# EAGLE design TSOC_RS485_EM_R5_0 (EAGLE 6.6.0)
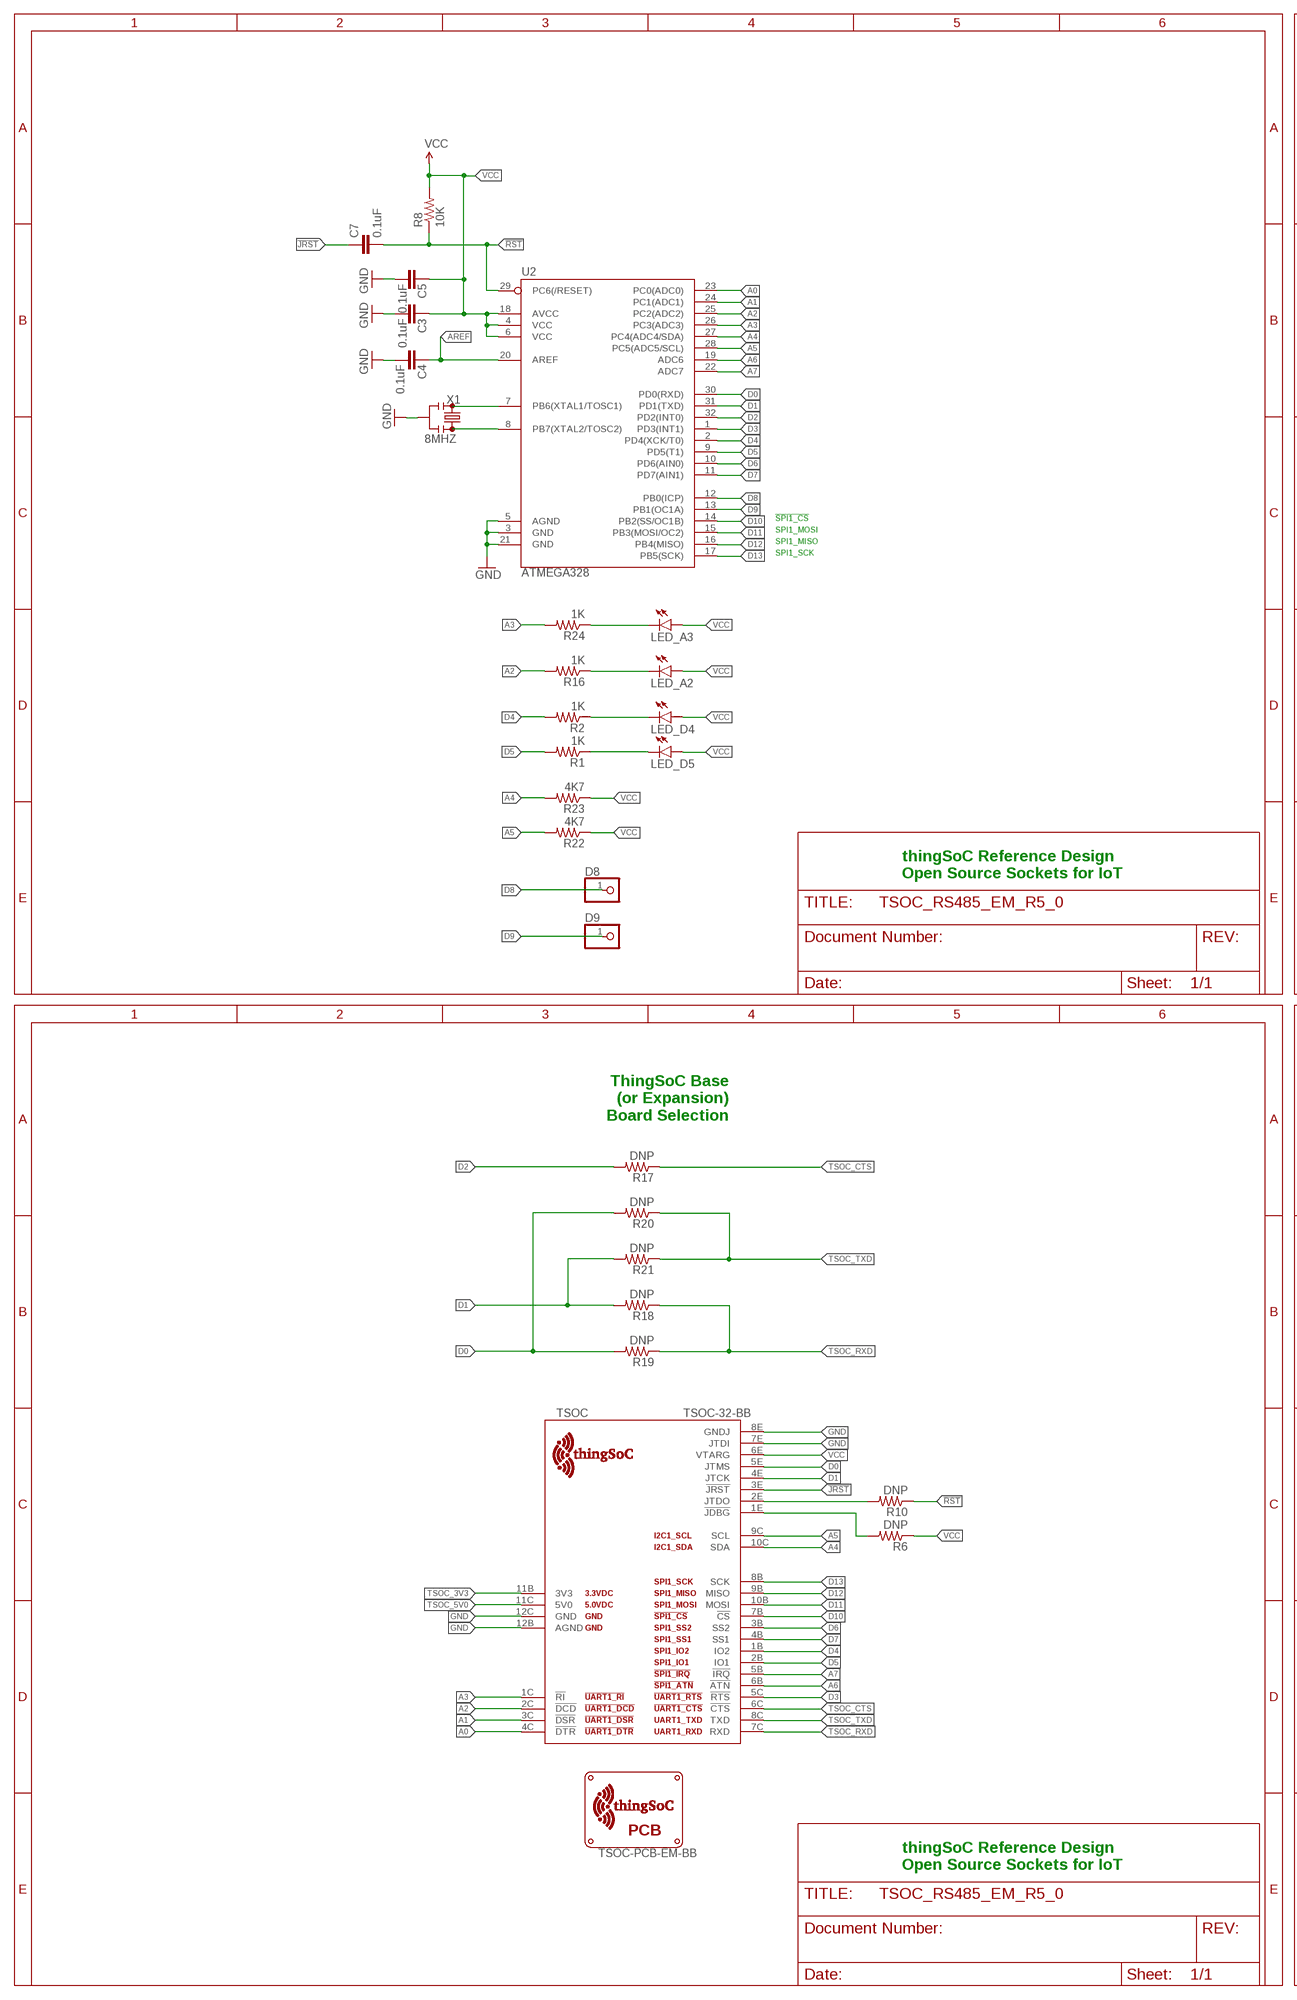
[diagram p0: schematic, sheet 1, part 1 of 2]
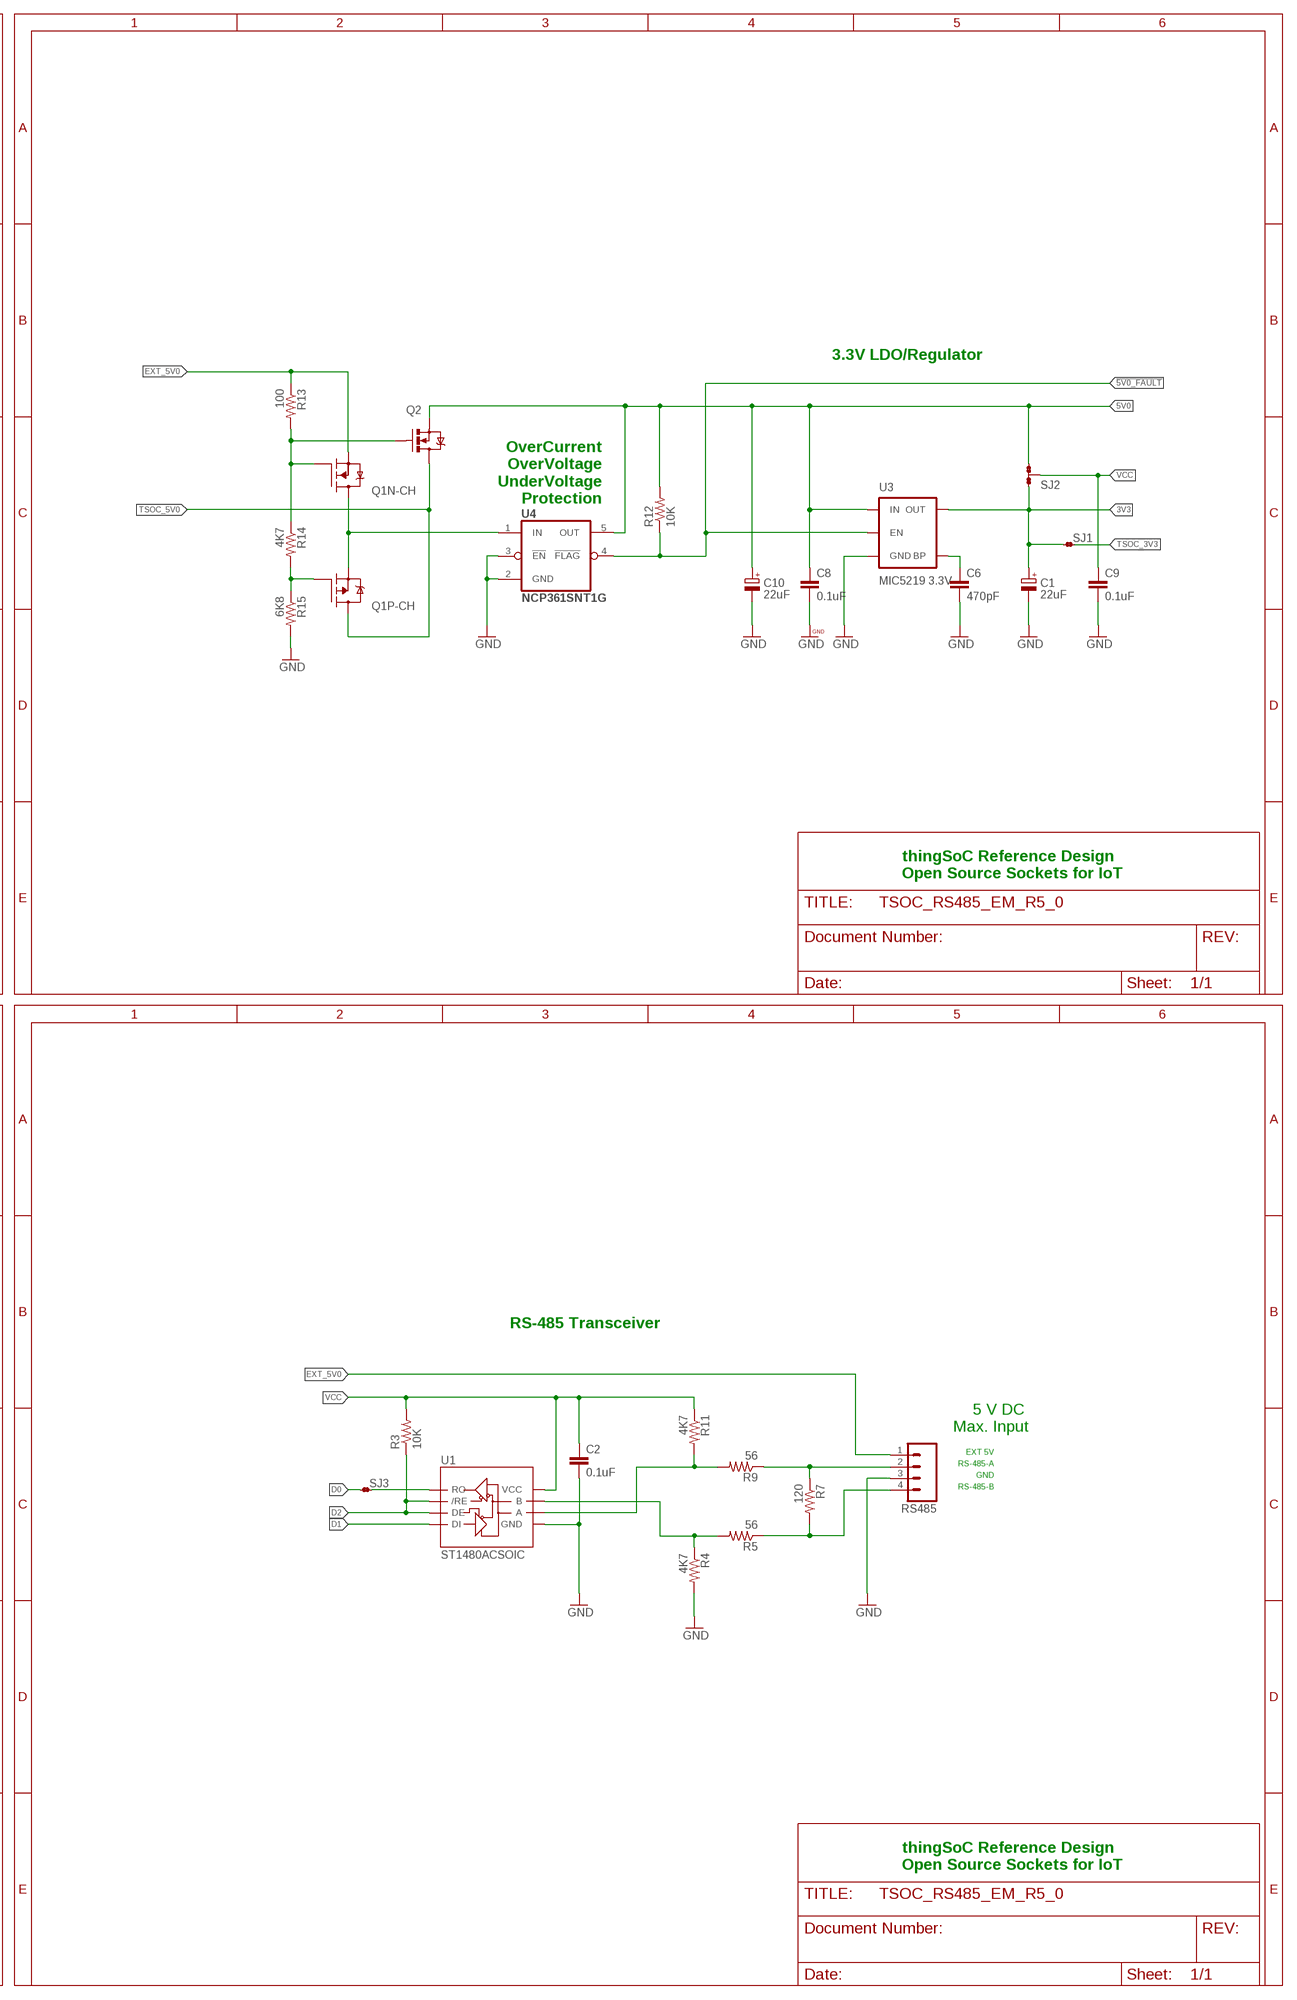
[diagram p1: schematic, sheet 1, part 2 of 2]

## Parts
C1  22uF  CPOL-EUSMCB  [SMC_B]
C2  0.1uF  CAP0402-CAP  [0402-CAP]
C3  0.1uF  CAP0402-CAP  [0402-CAP]
C4  0.1uF  CAP0402-CAP  [0402-CAP]
C5  0.1uF  CAP0402-CAP  [0402-CAP]
C6  470pF  CAP0402-CAP  [0402-CAP]
C7  0.1uF  CAP0402-CAP  [0402-CAP]
C8  0.1uF  CAP0402-CAP  [0402-CAP]
C9  0.1uF  CAP0402-CAP  [0402-CAP]
C10  22uF  CPOL-EUSMCB  [SMC_B]
D8  WPAD-1-0402  [WPAD-1-0402]
D9  WPAD-1-0402  [WPAD-1-0402]
LED_A2  LED0603  [LED-0603]
LED_A3  LED0603  [LED-0603]
LED_D4  LED0603  [LED-0603]
LED_D5  LED0603  [LED-0603]
Q1  FDC6420C  [SOT95P280X110-6N]
Q2  MOSFET-NCHANNELAO3404A  [SOT23-3]
R1  1K  RESISTOR0402  [0402-RES]
R2  1K  RESISTOR0402  [0402-RES]
R3  10K  RESISTOR0402  [0402-RES]
R4  4K7  RESISTOR0402  [0402-RES]
R5  56  RESISTOR0402  [0402-RES]
R6  DNP  RESISTOR0402  [0402-RES]
R7  120  RESISTOR0402  [0402-RES]
R8  10K  RESISTOR0402  [0402-RES]
R9  56  RESISTOR0402  [0402-RES]
R10  DNP  RESISTOR0402  [0402-RES]
R11  4K7  RESISTOR0402  [0402-RES]
R12  10K  RESISTOR0402  [0402-RES]
R13  100  RESISTOR0402  [0402-RES]
R14  4K7  RESISTOR0402  [0402-RES]
R15  6K8  RESISTOR0402  [0402-RES]
R16  1K  RESISTOR0402  [0402-RES]
R17  DNP  RESISTOR0402  [0402-RES]
R18  DNP  RESISTOR0402  [0402-RES]
R19  DNP  RESISTOR0402  [0402-RES]
R20  DNP  RESISTOR0402  [0402-RES]
R21  DNP  RESISTOR0402  [0402-RES]
R22  4K7  RESISTOR0402  [0402-RES]
R23  4K7  RESISTOR0402  [0402-RES]
R24  1K  RESISTOR0402  [0402-RES]
RS485  M04SCREW  [SCREWTERMINAL-3.5MM-4]
SJ1  JMP-2-NC  [JMP-2-NC]
SJ2  JMP-3-1_2  [JMP-3-1_2]
SJ3  JMP-2-NC  [JMP-2-NC]
TSOC  TSOC-32-BB  [TSOC-BB-S32]
U1  ST1480ACSOIC  [SO08]
U2  ATMEGA328  ATMEGA168  [TQFP32-08]
U3  MIC5219 3.3V  V_REG_MIC52193.3V  [SOT23-5]
U4  NCP361SNT1G  [SOP95P275X110-5N]
U$1  TSOC-PCB-EM-BB  [TSOC-EM-BB]
X1  8MHZ  RESONATOR8MHZ  [RESONATOR-SMD]

## Nets
3V3: C1.+ SJ1.1 SJ2.1 U3.5(OUT)
5V0: C8.1 C10.+ Q2.2(S) R12.2 SJ2.3 U3.1(IN) U4.5(OUT)
!5V0_FAULT: R12.1 U3.3(EN) U4.4(!FLAG)
!JDBG: R6.2 TSOC.1E(!JDBG)
!JRST: C7.1 TSOC.3E(!JRST)
!RST: C7.2 R8.1 R10.1 U2.29(PC6(/RESET))
A: R9.2 R11.2 U1.6(A)
A0: TSOC.4C(!DTR) U2.23(PC0(ADC0))
A1: TSOC.3C(!DSR) U2.24(PC1(ADC1))
A2: R16.2 TSOC.2C(!DCD) U2.25(PC2(ADC2))
A3: R24.2 TSOC.1C(!RI) U2.26(PC3(ADC3))
A4: R23.2 TSOC.10C(SDA) U2.27(PC4(ADC4/SDA))
A5: R22.2 TSOC.9C(SCL) U2.28(PC5(ADC5/SCL))
A6: TSOC.6B(!ATN) U2.19(ADC6)
A7: TSOC.5B(!IRQ) U2.22(ADC7)
AO: R7.1 R9.1 RS485.2
AREF: C4.2 U2.20(AREF)
B: R4.1 R5.2 U1.7(B)
BO: R5.1 R7.2 RS485.4
BYPASS1: C6.1 U3.4(BP)
D0: R19.2 R20.2 SJ3.1 TSOC.5E(JTMS) U2.30(PD0(RXD))
D1: R18.2 R21.2 TSOC.4E(JTCK) U1.4(DI) U2.31(PD1(TXD))
D2: R3.1 R17.2 U1.2(/RE) U1.3(DE) U2.32(PD2(INT0))
D3: TSOC.5C(!RTS) U2.1(PD3(INT1))
D4: R2.2 TSOC.1B(IO2) U2.2(PD4(XCK/T0))
D5: R1.2 TSOC.2B(IO1) U2.9(PD5(T1))
D6: TSOC.3B(SS2) U2.10(PD6(AIN0))
D7: TSOC.4B(SS1) U2.11(PD7(AIN1))
D8: D8.1 U2.12(PB0(ICP))
D9: D9.1 U2.13(PB1(OC1A))
D10: TSOC.7B(!CS) U2.14(PB2(SS/OC1B))
D11: TSOC.10B(MOSI) U2.15(PB3(MOSI/OC2))
D12: TSOC.9B(MISO) U2.16(PB4(MISO))
D13: TSOC.8B(SCK) U2.17(PB5(SCK))
EXT_5V0: Q1.5(N-CH:S) R13.1 RS485.1
GND: C1.- C2.2 C3.1 C4.1 C5.1 C6.2 C8.2 C9.2 C10.- R4.2 R15.2 RS485.3 TSOC.7E(JTDI) TSOC.8E(GNDJ) TSOC.12B(AGND) TSOC.12C(GND) U1.5(GND) U2.3(GND) U2.5(AGND) U2.21(GND) U3.2(GND) U4.2(GND) U4.3(!EN) X1.2
JTDO: R10.2 TSOC.2E(JTDO)
LEDB: LED_D4.C R2.1
LEDG: LED_A2.C R16.1
LEDR: LED_A3.C R24.1
LEDY: LED_D5.C R1.1
NGATE: Q1.1(N-CH:G) Q2.1(G) R13.2 R14.1
PGATE: Q1.3(P-CH:G) R14.2 R15.1
RXD: SJ3.2 U1.1(RO)
TSOC_3V3: SJ1.2 TSOC.11B(3V3)
TSOC_5V0: Q1.4(P-CH:D) Q2.3(D) TSOC.11C(5V0)
TSOC_CTS: R17.1 TSOC.6C(!CTS)
TSOC_RXD: R18.1 R19.1 TSOC.7C(RXD)
TSOC_TXD: R20.1 R21.1 TSOC.8C(TXD)
VCC: C2.1 C3.2 C5.2 C9.1 LED_A2.A LED_A3.A LED_D4.A LED_D5.A R3.2 R6.1 R8.2 R11.1 R22.1 R23.1 SJ2.2 TSOC.6E(VTARG) U1.8(VCC) U2.4(VCC) U2.6(VCC) U2.18(AVCC)
VIN: Q1.2(P-CH:S) Q1.6(N-CH:D) U4.1(IN)
XIN: U2.7(PB6(XTAL1/TOSC1)) X1.3
XOUT: U2.8(PB7(XTAL2/TOSC2)) X1.1

## Notes on the sheet
- 3.3V LDO/Regulator
- OverCurrent
  OverVoltage
  UnderVoltage
  Protection
- !SPI1_CS
- SPI1_MOSI
- SPI1_MISO
- SPI1_SCK
- thingSoC Reference Design
  Open Source Sockets for IoT
- thingSoC Reference Design
  Open Source Sockets for IoT
- ThingSoC Base
  (or Expansion)
  Board Selection
- RS-485 Transceiver
- 5 V DC 
  Max. Input
- EXT 5V
- RS-485-A
- GND
- RS-485-B
- thingSoC Reference Design
  Open Source Sockets for IoT
- thingSoC Reference Design
  Open Source Sockets for IoT

## Library data of the parts
C1 C10 = rcl:CPOL-EU: POLARIZED CAPACITOR, European symbol
C2-C9 = TSOC-MODBUS-ESM:CAP: Capacitor Standard 0603 ceramic capacitor, and 0.1" leaded capacitor.
D8 D9 = PatternAgents-ProtoPads:WPAD-1: Wire Pad - Single Good for scope lead clips, test jumpers, probe points, etc. PatternAgents ProtoPads Library Schematic and PCB layout libraries for design patterns by PatternAgents. For the CADSoft Eagle CAD program : http://www.cadsoftusa.com/download-eagle/ Source LBR : http://www.patternagents.com Github : https://github.com/PatternAgents License : http://creativecommons.org/licenses/by-sa/4.0/ (Creative Commons 4.0) THIS SOFTWARE IS PROVIDED BY THE CONTRIBUTORS "AS IS" AND WITHOUT ANY EXPRESS OR IMPLIED WARRANTIES, INCLUDING, BUT NOT LIMITED TO, THE IMPLIED WARRANTIES OF MERCHANTABILITY AND FITNESS FOR A PARTICULAR PURPOSE ARE DISCLAIMED. IN NO EVENT SHALL THE COPYRIGHT OWNER OR CONTRIBUTORS BE LIABLE FOR ANY DIRECT, INDIRECT, INCIDENTAL, SPECIAL, EXEMPLARY, OR CONSEQUENTIAL DAMAGES (INCLUDING, BUT NOT LIMITED TO, PROCUREMENT OF SUBSTITUTE GOODS OR SERVICES; LOSS OF USE, DATA, OR PROFITS; OR BUSINESS INTERRUPTION) HOWEVER CAUSED AND ON ANY THEORY OF LIABILITY, WHETHER IN CONTRACT, STRICT LIABILITY, OR TORT (INCLUDING NEGLIGENCE OR OTHERWISE) ARISING IN ANY WAY OUT OF THE USE OF THIS SOFTWARE, EVEN IF ADVISED OF THE POSSIBILITY OF SUCH DAMAGE.; BOM: EXCLUDE
LED_A2 LED_A3 LED_D4 LED_D5 = TSOC-MODBUS-ESM:LED: LEDs Standard schematic elements and footprints for 5mm, 3mm, 1206, and 0603 sized LEDs. 5mm - Spark Fun Electronics SKU : COM-00529 (and others)
Q1 = TSOC-ESP8266-BASE:FDC6420C: N and P Channel Power Trench MOSFETs
Q2 = SparkFun-DiscreteSemi:MOSFET-NCHANNEL: Common NMOSFET Parts MFG P/N Store ID Prod ID FDD8780 TRANS-09984 SI7820DN TRANS-11055 FDS6630A IC-08089 2N7002PW TRANS-11151 FQP30N06L COM-10213 TRANS-10060 BSS123LT1G TRANS-08345 BSS138 TRANS-00830 BS170 2N7000; PROD_ID: TRAN-12988
R1-R24 = TSOC-MODBUS-ESM:RESISTOR: Resistor Basic schematic elements and footprints for 0603, 1206, and PTH resistors.
RS485 = SparkFun-Connectors:M04: Header 4 Standard 4-pin 0.1" header. Use with straight break away headers (SKU : PRT-00116), right angle break away headers (PRT-00553), swiss pins (PRT-00743), machine pins (PRT-00117), and female headers (PRT-00115). Molex polarized connector foot print use with SKU : PRT-08231 with associated crimp pins and housings. 1MM SMD Version SKU: PRT-10208
SJ1 SJ3 = TSOC-MODBUS-ESM:JMP-2-NC: Two Terminal Jumper - Normally Closed Positions 1 and 2 are normally connected. PatternAgents ProtoPads Library Schematic and PCB layout libraries for design patterns by PatternAgents. For the CADSoft Eagle CAD program : http://www.cadsoftusa.com/download-eagle/ Source LBR : http://www.patternagents.com Github : https://github.com/PatternAgents License : http://creativecommons.org/licenses/by-sa/4.0/ (Creative Commons 4.0) THIS SOFTWARE IS PROVIDED BY THE CONTRIBUTORS "AS IS" AND WITHOUT ANY EXPRESS OR IMPLIED WARRANTIES, INCLUDING, BUT NOT LIMITED TO, THE IMPLIED WARRANTIES OF MERCHANTABILITY AND FITNESS FOR A PARTICULAR PURPOSE ARE DISCLAIMED. IN NO EVENT SHALL THE COPYRIGHT OWNER OR CONTRIBUTORS BE LIABLE FOR ANY DIRECT, INDIRECT, INCIDENTAL, SPECIAL, EXEMPLARY, OR CONSEQUENTIAL DAMAGES (INCLUDING, BUT NOT LIMITED TO, PROCUREMENT OF SUBSTITUTE GOODS OR SERVICES; LOSS OF USE, DATA, OR PROFITS; OR BUSINESS INTERRUPTION) HOWEVER CAUSED AND ON ANY THEORY OF LIABILITY, WHETHER IN CONTRACT, STRICT LIABILITY, OR TORT (INCLUDING NEGLIGENCE OR OTHERWISE) ARISING IN ANY WAY OUT OF THE USE OF THIS SOFTWARE, EVEN IF ADVISED OF THE POSSIBILITY OF SUCH DAMAGE.; BOM: EXCLUDE
SJ2 = PatternAgents-ProtoPads:JMP-3-1_2: Three Terminal Jumper - 1 & 2 Connected Positions 1and 2 are normally connected. PatternAgents ProtoPads Library Schematic and PCB layout libraries for design patterns by PatternAgents. For the CADSoft Eagle CAD program : http://www.cadsoftusa.com/download-eagle/ Source LBR : http://www.patternagents.com Github : https://github.com/PatternAgents License : http://creativecommons.org/licenses/by-sa/4.0/ (Creative Commons 4.0) THIS SOFTWARE IS PROVIDED BY THE CONTRIBUTORS "AS IS" AND WITHOUT ANY EXPRESS OR IMPLIED WARRANTIES, INCLUDING, BUT NOT LIMITED TO, THE IMPLIED WARRANTIES OF MERCHANTABILITY AND FITNESS FOR A PARTICULAR PURPOSE ARE DISCLAIMED. IN NO EVENT SHALL THE COPYRIGHT OWNER OR CONTRIBUTORS BE LIABLE FOR ANY DIRECT, INDIRECT, INCIDENTAL, SPECIAL, EXEMPLARY, OR CONSEQUENTIAL DAMAGES (INCLUDING, BUT NOT LIMITED TO, PROCUREMENT OF SUBSTITUTE GOODS OR SERVICES; LOSS OF USE, DATA, OR PROFITS; OR BUSINESS INTERRUPTION) HOWEVER CAUSED AND ON ANY THEORY OF LIABILITY, WHETHER IN CONTRACT, STRICT LIABILITY, OR TORT (INCLUDING NEGLIGENCE OR OTHERWISE) ARISING IN ANY WAY OUT OF THE USE OF THIS SOFTWARE, EVEN IF ADVISED OF THE POSSIBILITY OF SUCH DAMAGE.; BOM: EXCLUDE
TSOC = thingSoC:TSOC-32: thingSoC Thirty-Two (32) Pin Socket Source LBR : http://www.thingsoc.com Github : https://github.com/thingsoc License : http://creativecommons.org/licenses/by-sa/4.0/ (Creative Commons 4.0) THIS SOFTWARE IS PROVIDED BY THE CONTRIBUTORS "AS IS" AND WITHOUT ANY EXPRESS OR IMPLIED WARRANTIES, INCLUDING, BUT NOT LIMITED TO, THE IMPLIED WARRANTIES OF MERCHANTABILITY AND FITNESS FOR A PARTICULAR PURPOSE ARE DISCLAIMED. IN NO EVENT SHALL THE COPYRIGHT OWNER OR CONTRIBUTORS BE LIABLE FOR ANY DIRECT, INDIRECT, INCIDENTAL, SPECIAL, EXEMPLARY, OR CONSEQUENTIAL DAMAGES (INCLUDING, BUT NOT LIMITED TO, PROCUREMENT OF SUBSTITUTE GOODS OR SERVICES; LOSS OF USE, DATA, OR PROFITS; OR BUSINESS INTERRUPTION) HOWEVER CAUSED AND ON ANY THEORY OF LIABILITY, WHETHER IN CONTRACT, STRICT LIABILITY, OR TORT (INCLUDING NEGLIGENCE OR OTHERWISE) ARISING IN ANY WAY OUT OF THE USE OF THIS SOFTWARE, EVEN IF ADVISED OF THE POSSIBILITY OF SUCH DAMAGE.
U1 = TSOC-MODBUS-ESM:ST1480AC: ST Microelectronics ST1480AC RS-485/RS-422 Transceiver Source : http://www.st.com/web/en/resource/technical/document/datasheet/CD00003136.pdf The ST1480Ax is ±15 kV ESD protected, 3.3 V low power transceiver for RS-485 and RS-422 communications. The device contains one driver and one receiver in half duplex configuration. The ST1480Ax transmits and receives at a guaranteed data rate of at least 12 Mbps. All transmitter outputs and receiver inputs are protected to ±15 kV using Human Body Model. Driver is short-circuit current limited and is protected against excessive power dissipation by thermal shutdown circuitry that places the driver outputs into a high-impedance state. The ST1480Ax input has a true fail-safe feature that guarantees a logic high output if both inputs are open circuit, shorted together or in the presence of a termination with no signal on the bus.
U2 = SparkFun:ATMEGA168
U3 = TSOC-ESP8266-BASE:V_REG_MIC5219: V_REG MIC5219 Standard 3.3V and 5V 500mA LDO voltage regulator in SOT-23 layout. Micrel part MIC5219. BP (by-pass) pin is used to lower output noise with 470pF cap, may be left open.; PROD_ID: VREG-09872
U4 = TSOC-ESP8266-BASE:NCP361SNT1G: USB Positive Overvoltage Protection Controller; MPN: NCP361SNT1G; OC_FARNELL: 1642242; OC_NEWARK: 01P0135; PACKAGE: TSOP-5; SUPPLIER: ON Semiconductor
U$1 = TSOC_RS485_EM:TSOC-PCB: thingSoC PCB Outlines Boards Outlines for Standard Sizes (in the DImension Layer) (Registration marks in the tDocu layer - make sure to turn on tDocu/bDocu) Source LBR : http://www.thingsoc.com Github : https://github.com/thingsoc License : http://creativecommons.org/licenses/by-sa/4.0/ (Creative Commons 4.0) THIS SOFTWARE IS PROVIDED BY THE CONTRIBUTORS "AS IS" AND WITHOUT ANY EXPRESS OR IMPLIED WARRANTIES, INCLUDING, BUT NOT LIMITED TO, THE IMPLIED WARRANTIES OF MERCHANTABILITY AND FITNESS FOR A PARTICULAR PURPOSE ARE DISCLAIMED. IN NO EVENT SHALL THE COPYRIGHT OWNER OR CONTRIBUTORS BE LIABLE FOR ANY DIRECT, INDIRECT, INCIDENTAL, SPECIAL, EXEMPLARY, OR CONSEQUENTIAL DAMAGES (INCLUDING, BUT NOT LIMITED TO, PROCUREMENT OF SUBSTITUTE GOODS OR SERVICES; LOSS OF USE, DATA, OR PROFITS; OR BUSINESS INTERRUPTION) HOWEVER CAUSED AND ON ANY THEORY OF LIABILITY, WHETHER IN CONTRACT, STRICT LIABILITY, OR TORT (INCLUDING NEGLIGENCE OR OTHERWISE) ARISING IN ANY WAY OUT OF THE USE OF THIS SOFTWARE, EVEN IF ADVISED OF THE POSSIBILITY OF SUCH DAMAGE.
X1 = TSOC_RS485_EM:RESONATOR: Resonator Small SMD resonator. Used, eg, on the Arduino Pro/ Pro Mini boards. 8MHz- XTAL-08895 16MHz- XTAL-08900; PROD_ID: XTAL-08895

## Net classes
1 vcc: width 0.254 mm

## Board
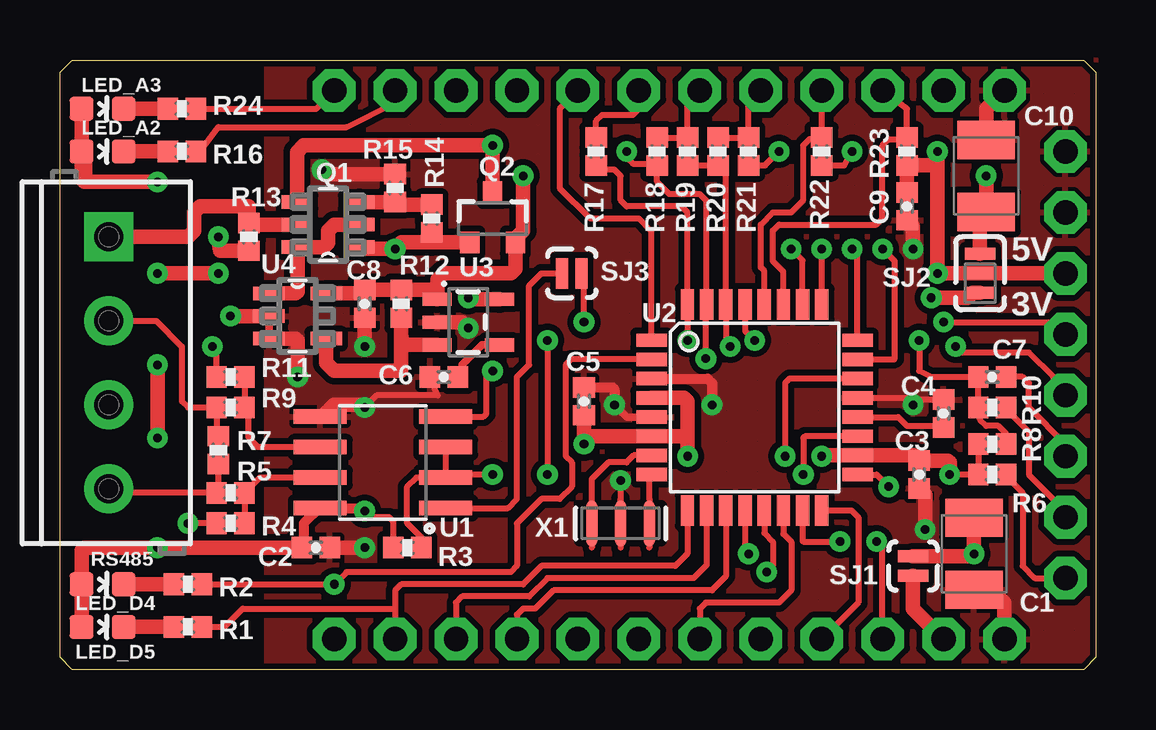
[diagram p2: board, top side]
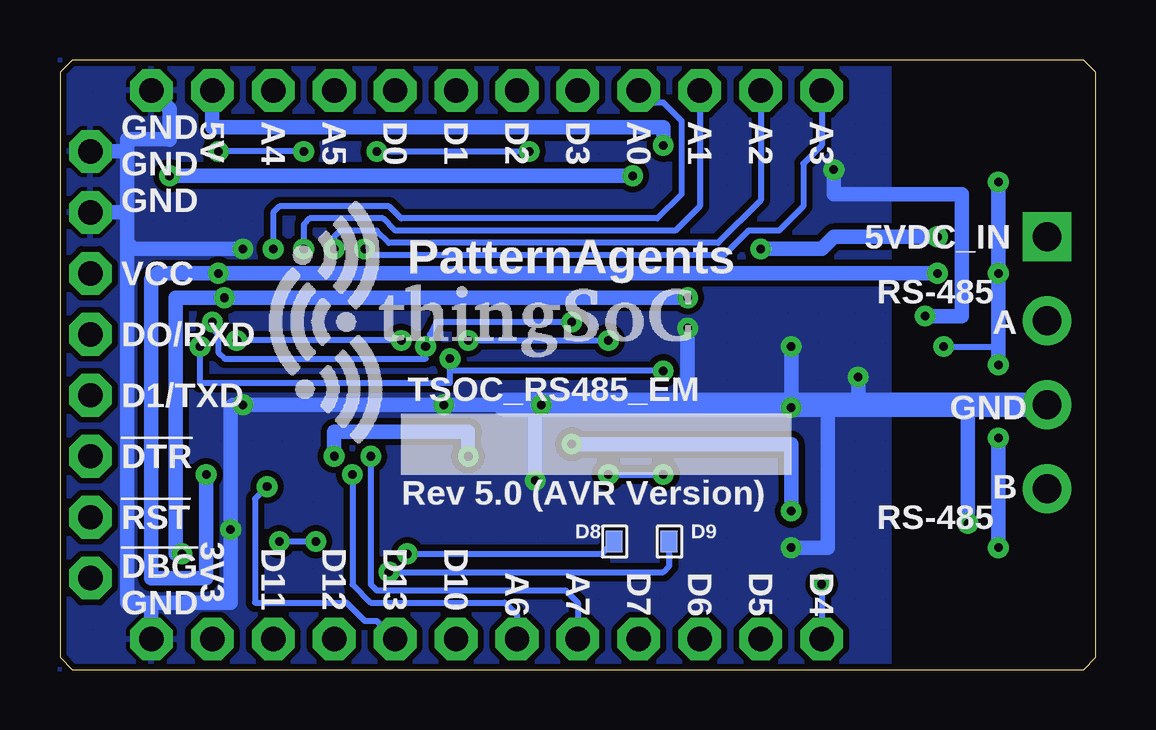
[diagram p3: board, bottom side, seen from below]

Size 43.18 x 25.4 mm. Coordinates in mm from the lower left corner, seen from the top.
Copper layers (1*16): Top 0.035mm / dielectric 1.5mm / Bottom 0.035mm
Design rules "PatternAgents_7mil": minimum track width 7mil, minimum drill 14mil, track to track 7mil, track to pad 7mil, pad to pad 7mil, via to via 7mil, smd to smd 7mil, copper to edge 7mil, drill to drill 7mil, minimum pad ring 12mil, minimum via ring 10mil, stop-mask expansion 4mil, vias tented up to drill 25mil, thermal gap 7mil

### Footprints (pad centres in the part's own frame; a part is rotated, then mirrored left to right if it is on the bottom)
SMC_B = smd 1.6 x 2.4: + -1.5,0; - 1.5,0
0402-CAP = smd 0.85 x 0.9: 1 -0.58,0; 2 0.58,0
WPAD-1-0402 = smd 0.7 x 0.9: 1 -0.015,0
LED-0603 = smd 1 x 1: A 0,-0.877; C 0,0.877
SOT95P280X110-6N = smd 1.27 x 0.559: 1 -1.295,0.94; 2 -1.295,0; 3 -1.295,-0.94; 4 1.295,-0.94; 5 1.295,0; 6 1.295,0.94
SOT23-3 = smd 0.8 x 0.9: 1 -0.95,-1; 2 0.95,-1; 3 0,1.1
0402-RES = smd 0.85 x 0.9: 1 -0.58,0; 2 0.58,0
SCREWTERMINAL-3.5MM-4 = drill 1.2 pad 2.032 square: 1 0,0 | drill 1.2 pad 2.032: 2 3.5,0; 3 7,0; 4 10.5,0
JMP-2-NC = smd 0.508 x 1.27: 1 -0.401,0; 2 0.413,0
JMP-3-1_2 = smd 0.508 x 1.27: 1 -0.813,0; 2 0,0; 3 0.813,0
TSOC-BB-S32 = drill 1.016 pad 1.778 octagon: 1B -11.43,-11.43; 1C -11.43,11.43; 1E 19.05,-8.89; 2B -8.89,-11.43; 2C -8.89,11.43; 2E 19.05,-6.35; 3B -6.35,-11.43; 3C -6.35,11.43; 3E 19.05,-3.81; 4B -3.81,-11.43; 4C -3.81,11.43; 4E 19.05,-1.27; 5B -1.27,-11.43; 5C -1.27,11.43; 5E 19.05,1.27; 6B 1.27,-11.43; 6C 1.27,11.43; 6E 19.05,3.81; 7B 3.81,-11.43; 7C 3.81,11.43; 7E 19.05,6.35; 8B 6.35,-11.43; 8C 6.35,11.43; 8E 19.05,8.89; 9B 8.89,-11.43; 9C 8.89,11.43; 10B 11.43,-11.43; 10C 11.43,11.43; 11B 13.97,-11.43; 11C 13.97,11.43; 12B 16.51,-11.43; 12C 16.51,11.43
SO08 = smd 0.61 x 2.21: 1 -1.905,-2.616; 2 -0.635,-2.616; 3 0.635,-2.616; 4 1.905,-2.616; 5 1.905,2.616; 6 0.635,2.616; 7 -0.635,2.616; 8 -1.905,2.616
TQFP32-08 = smd 1.27 x 0.559: 1 -4.293,2.8; 2 -4.293,2; 3 -4.293,1.2; 4 -4.293,0.4; 5 -4.293,-0.4; 6 -4.293,-1.2; 7 -4.293,-2; 8 -4.293,-2.8; 17 4.293,-2.8; 18 4.293,-2; 19 4.293,-1.2; 20 4.293,-0.4; 21 4.293,0.4; 22 4.293,1.2; 23 4.293,2; 24 4.293,2.8 | smd 0.559 x 1.27: 9 -2.8,-4.293; 10 -2,-4.293; 11 -1.2,-4.293; 12 -0.4,-4.293; 13 0.4,-4.293; 14 1.2,-4.293; 15 2,-4.293; 16 2.8,-4.293; 25 2.8,4.293; 26 2,4.293; 27 1.2,4.293; 28 0.4,4.293; 29 -0.4,4.293; 30 -1.2,4.293; 31 -2,4.293; 32 -2.8,4.293
SOT23-5 = smd 0.55 x 1.2: 1 -0.95,-1.3; 2 0,-1.3; 3 0.95,-1.3; 4 0.95,1.3; 5 -0.95,1.3
SOP95P275X110-5N = smd 1.321 x 0.559: 1 -1.194,0.94; 2 -1.194,0; 3 -1.194,-0.94; 4 1.194,-0.94; 5 1.194,0.94
RESONATOR-SMD = smd 0.45 x 1.905: 1 -1.2,0; 2 0,0; 3 1.2,0

### Placement (x,y rotation side)
C1  38.1,4.83 270 top
C2  10.67,5.08 0 top
C3  35.81,8.13 90 top
C4  36.83,10.67 270 top
C5  21.84,11.18 270 top
C6  16,12.19 180 top
C7  38.86,12.19 180 top
C8  12.7,15.24 270 top
C9  35.31,19.3 270 top
C10  38.61,20.57 90 top
D8  20.07,5.33 0 bottom
D9  17.78,5.33 0 bottom
LED_A2  1.78,21.59 270 top
LED_A3  1.78,23.37 270 top
LED_D4  1.78,3.56 270 top
LED_D5  1.78,1.78 270 top
Q1  11.18,18.54 180 top
Q2  18.03,18.8 0 top
R1  5.33,1.78 0 top
R2  5.33,3.56 0 top
R3  14.48,5.08 180 top
R4  7.11,6.1 180 top
R5  7.11,7.37 0 top
R6  38.86,8.13 0 top
R7  6.6,9.14 270 top
R8  38.86,9.4 180 top
R9  7.11,10.92 0 top
R10  38.86,10.92 0 top
R11  7.11,12.19 0 top
R12  14.22,15.24 90 top
R13  7.87,18.03 270 top
R14  15.49,18.8 90 top
R15  13.97,20.07 90 top
R16  5.08,21.59 0 top
R17  22.35,21.59 270 top
R18  24.89,21.59 270 top
R19  26.16,21.59 270 top
R20  27.43,21.59 270 top
R21  28.7,21.59 270 top
R22  31.75,21.59 90 top
R23  35.31,21.59 90 top
R24  5.08,23.37 0 top
RS485  2.03,18.03 270 top
SJ1  35.56,4.32 270 top
SJ2  38.35,16.51 90 top
SJ3  21.34,16.51 180 top
TSOC  22.86,12.7 0 top
U1  13.46,8.64 90 top
U2  28.96,10.92 0 top
U3  17.02,14.48 270 top
U4  9.91,14.73 0 top
U$1  21.59,12.7 0 top
U$100  TSOC-LOGO-LRG  [TSOC-LOGO-LRG]  31.24,14.48 0 bottom
X1  23.37,6.1 180 top

### Tracks (layer width: path | path; a pad name or v marks a point on that pad's centre or on a via)
3V3  (via drill 0.36)
  Top 0.61: U3.5 17.08,15.43 v17.02,15.49 | C1.+ v38.1,4.83 37.99,4.72 SJ1.1 | SJ2.1 38.05,15.7 37.85,15.49 v36.32,15.49
  Bottom 0.61: v17.02,15.49 v36.32,15.49 38.35,15.49 38.35,4.83 v38.1,4.83
5V0  (via drill 0.36)
  Top 0.61: U4.5 12.55,15.67 C8.1 R12.2 15.6,15.82 U3.1 15.75,15.46 15.75,16.26 16,16.51 18.8,16.51 18.98,16.7 Q2.2 18.98,17.97 19.3,18.29 v19.3,20.57 | 38.86,18.82 C10.+ | v38.61,20.57 C10.+ | SJ2.3 38.35,18.82 C10.+
  Bottom 0.61: v19.3,20.57 v38.61,20.57
!5V0_FAULT
  Top 0.61: 14.22,13.97 R12.1 | U3.3 14.29,13.53 14.22,13.97 | U4.4 11.1,12.78 11.43,12.45 14.22,12.45 14.22,13.97
!JDBG
  Top 0.254: R6.2 39.44,8.06 40.13,7.37 40.13,4.32 40.64,3.81 TSOC.1E
!JRST
  Top 0.254: TSOC.3E 41.91,9.4 40.39,10.92 40.39,11.94 40.13,12.19 C7.1
!RST  (via drill 0.36)
  Top 0.254: R8.1 39.44,9.83 39.12,10.16 38.61,10.16 38.35,10.41 38.35,10.85 R10.1 C7.2 36.32,12.19 35.81,12.45 v35.81,13.72 | U2.29 28.56,14.12 v28.96,13.72
  Bottom 0.254: v28.96,13.72 v35.81,13.72
A
  Top 0.254: R11.2 R9.2 7.87,10.74 7.87,9.65 8.25,9.27 U1.6
A0  (via drill 0.36)
  Top 0.254: U2.23 34.77,12.92 34.8,12.95 34.8,17.02 v34.29,17.53
  Bottom 0.254: v34.29,17.53 34.29,19.05 34.04,19.3 29.46,19.3 28.96,18.8 18.29,18.8 17.27,19.81 17.27,22.86 18.03,23.62 18.54,23.62 TSOC.4C
A1  (via drill 0.36)
  Top 0.254: U2.24 33.25,17.3 v33.02,17.53
  Bottom 0.254: v33.02,17.53 33.02,18.54 32.77,18.8 29.72,18.8 29.21,18.29 17.53,18.29 16.51,19.3 TSOC.3C
A2  (via drill 0.36)
  Top 0.254: R16.2 5.84,21.59 6.6,22.61 11.94,22.61 13.97,23.62 TSOC.2C | U2.25 31.76,17.01 v31.75,17.53
  Bottom 0.254: v31.75,17.53 31.75,18.03 31.5,18.29 29.97,18.29 29.46,17.78 15.75,17.78 13.97,19.56 TSOC.2C
A3  (via drill 0.36)
  Top 0.254: R24.2 10.67,23.37 TSOC.1C | U2.26 30.96,17.05 v30.48,17.53
  Bottom 0.254: 30.48,17.27 v30.48,17.53 30.23,17.27 15.49,17.27 14.48,18.29 13.21,18.29 12.19,19.3 12.19,21.08 11.43,21.84 TSOC.1C
A4
  Top 0.254: TSOC.10C 35.31,23.37 R23.2 34.98,22.1 34.54,22.1 34.29,21.84 34.29,18.8 34.04,18.54 29.97,18.54 29.72,18.29 29.72,17.02 30.16,16.58 U2.27
A5
  Top 0.254: TSOC.9C R22.2 31.68,22.1 31.24,22.1 30.99,21.84 30.99,19.56 30.48,19.05 29.72,19.05 29.21,18.54 29.21,16.76 29.36,16.62 U2.28
A6  (via drill 0.36)
  Top 0.254: U2.19 31.06,9.72 30.99,9.65 v30.99,8.13
  Bottom 0.254: v30.99,8.13 30.99,3.56 30.23,2.79 24.64,2.79 24.13,2.29 TSOC.6B
A7  (via drill 0.36)
  Top 0.254: U2.22 30.41,12.12 30.23,11.94 v30.23,8.89
  Bottom 0.254: v30.23,8.89 30.23,3.56 29.97,3.3 22.1,3.3 21.59,2.79 TSOC.5B
AO
  Top 0.254: 6.28,11.18 R9.1 | RS485.2 4.01,14.53 5.08,13.46 5.08,11.18 5.33,10.92 R9.1 | R9.1 6.53,9.8 R7.1
AREF
  Top 0.254: C4.2 36.76,10.16 35.31,10.16 34.94,10.52 U2.20
B
  Top 0.254: R4.1 R5.2 8.33,8 U1.7
BO
  Top 0.254: R7.2 6.6,7.44 R5.1 2.2,7.37 RS485.4
BYPASS1
  Top 0.305: U3.4 17.59,13.53 16.76,12.7 16.76,12.37 C6.1
D0  (via drill 0.36)
  Top 0.254: v36.83,14.48 41.4,14.48 TSOC.5E | v27.94,13.46 27.76,13.65 U2.30 27.76,20.69 R20.2 R19.2 | v21.84,14.48 21.84,16.36 SJ3.1
  Bottom 0.254: v36.83,14.48 36.83,14.22 36.58,13.97 36.58,13.21 36.32,12.95 27.94,12.95 v27.94,13.46 27.76,13.65 27.76,13.97 27.5,14.48 v21.84,14.48
D1  (via drill 0.36)
  Top 0.254: TSOC.4E 41.4,11.94 41.4,12.19 40.39,13.21 37.59,13.21 v37.34,13.46 | U1.4 17.65,10.54 17.78,10.67 17.78,12.19 v18.03,12.45 | v26.92,12.95 26.92,15.18 U2.31 26.96,19.53 26.67,19.81 25.4,19.81 24.89,20.32 R18.2 24.82,21.08 23.88,21.08 23.62,21.34 v23.62,21.59 | R21.2 29.39,21.01 v29.97,21.59
  Bottom 0.254: v37.34,13.46 37.34,11.94 26.92,11.94 v26.92,12.95 26.92,12.45 v18.03,12.45 | v29.97,21.59 v23.62,21.59
D2  (via drill 0.36)
  Top 0.254: U1.3 U1.2 | R3.1 15.06,5.52 14.48,6.1 14.48,7.62 14.86,8 U1.2 | 26.13,15.24 U2.32 | U2.32 26.16,19.06 25.91,19.3 23.62,19.3 23.37,19.56 23.37,20.57 23.11,20.83 22.53,20.83 R17.2 | U2.32 v26.16,13.72 | v20.32,13.72 v20.32,8.13 | v18.03,8.13 16.2,8.13 U1.2
  Bottom 0.254: v26.16,13.72 v20.32,13.72 | v20.32,8.13 v18.03,8.13
D3
  Top 0.254: U2.1 24.64,13.75 24.64,18.29 24.13,18.8 22.1,18.8 20.83,20.07 20.83,23.37 TSOC.5C
D4  (via drill 0.36)
  Top 0.254: U2.2 21.3,12.92 21.08,12.7 21.08,8.89 21.34,8.64 21.34,7.62 20.83,7.11 20.07,7.11 19.05,6.1 19.05,4.32 18.8,4.06 11.94,4.06 v11.43,3.56 R2.2
  Bottom 0.254: v11.43,3.56 TSOC.1B
D5
  Top 0.254: R1.2 6.86,1.78 7.62,2.54 13.97,2.54 | 13.97,2.54 TSOC.2B | U2.9 26.16,4.82 25.65,4.32 20.07,4.32 19.3,3.56 14.22,3.56 13.97,3.3 13.97,2.54
D6
  Top 0.254: U2.10 26.96,4.35 26.42,3.81 20.32,3.81 19.56,3.05 16.76,3.05 16.51,2.79 TSOC.3B
D7
  Top 0.254: U2.11 27.76,3.88 27.18,3.3 20.57,3.3 19.81,2.54 19.3,2.54 19.05,2.29 TSOC.4B
D8  (via drill 0.36)
  Top 0.254: U2.12 28.56,4.93 v28.7,4.83
  Bottom 0.254: v28.7,4.83 20.59,4.83 D8.1
D9  (via drill 0.36)
  Top 0.254: U2.13 29.36,5.7 29.72,5.33 29.72,4.32 v29.46,4.06
  Bottom 0.254: v29.46,4.06 18.03,4.06 17.78,4.32 17.78,5.32 D9.1
D10
  Top 0.254: TSOC.7B 26.67,2.54 26.92,2.79 29.97,2.79 30.48,3.3 30.48,5.33 30.16,5.66 U2.14
D11  (via drill 0.36)
  Top 0.254: TSOC.10B 34.29,5.08 v34.04,5.33 | U2.15 30.96,5.37 30.99,5.33 v32.51,5.33
  Bottom 0.254: v32.51,5.33 v34.04,5.33
D12
  Top 0.254: TSOC.9B 33.27,2.79 33.27,6.35 32.99,6.63 U2.16
D13  (via drill 0.36)
  Top 0.254: U2.17 34.04,8.12 v34.54,7.62
  Bottom 0.254: v34.54,7.62 35.05,7.11 35.05,2.79 31.24,2.79 30.48,2.03 29.97,2.03 TSOC.8B
EXT_5V0
  Top 0.61: Q1.5 7.95,18.54 R13.1 7.87,19.3 5.84,19.3 5.59,19.05 5.59,18.29 5.33,18.03 RS485.1
GND  (via drill 0.36)
  Top 0.254: R4.2 v5.33,6.1 | C6.2 15.42,12.12 15.75,11.43 13.21,11.43 v12.7,10.92 | C4.1 35.77,11.25 v35.56,11.03 35.27,11.32 U2.21 | v23.37,7.87 X1.2
  Top 0.305: U4.2 U4.3 | U2.5 23.63,10.52 v23.11,11.03
  Top 0.406: U2.3 26.99,12.12 27.18,11.94 v27.18,11.03 | C5.1 23.04,11.76 23.11,11.68 v23.11,11.03
  Top 0.61: U4.3 9.83,13.79 9.91,13.72 v9.91,12.19 | C8.2 v12.7,13.46 | U3.2 16.76,14.48 v17.02,14.22 | C10.- 38.61,23.37 TSOC.12C | R15.2 11.1,20.65 v10.92,20.83 | v7.11,14.73 U4.2 | v36.07,5.84 36.07,7.29 C3.1 | U1.5 10.94,10.54 11.43,11.03 12.59,11.03 v12.7,10.92 | C2.2 v12.7,5.08 | C1.- 38.84,3.33 39.37,2.79 TSOC.12B | v35.56,17.53 35.56,18.47 C9.2
  Bottom 0.61: 24.64,11.03 v27.18,11.03 v35.56,11.03 35.96,11.03 36.07,10.92 v36.07,5.84 36.07,2.79 39.37,2.79 | v9.91,12.19 9.91,10.92 | 9.91,10.92 10.92,11.03 | v12.7,13.46 12.7,11.03 | v17.02,14.22 17.02,11.03 | v10.92,20.83 10.92,19.81 5.59,19.81 5.59,14.73 v7.11,14.73 | 40.39,19.05 40.39,21.59 | 40.39,21.59 40.39,22.1 38.63,22.1 C10.- 38.61,23.37 TSOC.12C | TSOC.8E 40.39,21.59 | TSOC.7E 40.39,19.05 | v5.33,6.1 5.33,10.78 5.59,11.03 | 39.37,2.79 40.39,2.79 40.39,17.78 | 40.39,17.78 40.39,19.05 | v35.56,17.53 40.13,17.53 40.39,17.78 | TSOC.12B 39.37,2.79 | v12.7,5.08 11.18,5.08 11.18,10.78 11.25,10.85 9.91,10.92 | v23.37,7.87 23.37,10.78 v23.11,11.03
  Bottom 0.813: v12.7,10.92 13.72,11.03
  Bottom 1.016: 10.92,11.03 12.7,11.03 13.72,11.03 17.02,11.03 v23.11,11.03 24.64,11.03 | RS485.3 5.59,11.03 10.78,11.03
  pour Top (isolate 0.254, hatched): 8.64,0 8.64,25.4 43.18,25.4 43.18,0
  pour Bottom (isolate 0.254, hatched): 8.64,0 8.64,25.4 43.18,25.4 43.18,0
  pour Top (isolate 0.254, hatched): 8.64,0 8.64,25.4 43.18,25.4 43.18,0
JTDO
  Top 0.254: TSOC.2E 41.91,6.6 40.39,8.13 40.39,9.91 39.44,10.85 R10.2
LEDB
  Top 0.61: LED_D4.C R2.1
LEDG
  Top 0.61: LED_A2.C R16.1
LEDR
  Top 0.61: LED_A3.C R24.1
LEDY
  Top 0.61: LED_D5.C R1.1
NGATE  (via drill 0.36)
  Top 0.61: R13.2 6.68,17.45 v6.6,18.03 | Q1.1 12.55,17.53 v13.97,17.53 14.24,17.8 15.49,17.8 | Q2.1 15.49,17.8 | R14.1 15.49,17.8
  Bottom 0.61: v6.6,18.03 10.92,18.03 11.43,17.53 v13.97,17.53
PGATE
  Top 0.61: R14.2 14.08,19.38 R15.1 Q1.3
RXD
  Top 0.254: U1.1 18.67,6.73 19.05,7.11 19.05,12.19 19.56,12.7 19.56,16 20.07,16.51 SJ3.2
TSOC_3V3
  Top 0.61: SJ1.2 35.56,2.54 TSOC.11B
TSOC_5V0  (via drill 0.36)
  Top 0.61: Q1.4 9.88,21.57 10.16,21.84 v18.03,21.84 Q2.3
  Bottom 0.61: TSOC.11C 36.83,22.61 18.03,22.61 v18.03,21.84
TSOC_CTS
  Top 0.254: R17.1 22.35,22.86 22.61,23.11 23.88,23.11 24.13,23.37 TSOC.6C
TSOC_RXD
  Top 0.254: R18.1 R19.1 26.16,23.62 TSOC.7C
TSOC_TXD
  Top 0.254: R20.1 R21.1 28.7,23.62 TSOC.8C
VCC  (via drill 0.36)
  Top 0.178: 1.27,20.32 1.27,21.59 LED_A2.A
  Top 0.254: R22.1 32.69,21.01 v33.02,21.59 | v37.08,8.13 R6.1 R8.2 | R11.1 6.53,13.28 v6.35,13.46 | R3.2 13.9,6.17 13.72,6.35 12.95,6.35 v12.7,6.6
  Top 0.406: v12.7,6.6 12.57,6.73 U1.8 10.79,6.73 10.16,6.1 10.16,5.08 9.4,5.08
  Top 0.61: LED_A3.A LED_A2.A 0.9,20.43 | 1.02,20.32 1.27,20.32 v4.06,20.32 | v4.06,16.51 v6.6,16.51 | C9.1 R23.1 36.39,21.01 36.58,20.83 | 36.58,20.83 v36.58,16.51 SJ2.2 TSOC.6E | 36.58,20.83 v36.58,21.59 | LED_D5.A LED_D4.A 0.9,4.96 1.02,5.08 v4.06,5.08 9.4,5.08 C2.1 | v4.06,12.7 v4.06,9.65 | v37.08,8.13 37.08,8.64 37.01,8.71 C3.2 35.6,8.92 U2.18 31.78,8.92 v31.75,8.89 | U2.4 26.02,11.32 26.16,11.18 26.16,9.65 | 26.16,9.65 v26.16,8.89 | 26.16,9.65 26.09,9.72 U2.6 22.17,9.72 v21.84,9.4 C5.2
  Bottom 0.254: v33.02,21.59 v36.58,21.59 | v6.35,13.46 4.32,13.46 4.06,13.72
  Bottom 0.61: v6.6,16.51 v36.58,16.51 39.12,16.51 39.37,16.26 39.37,3.81 37.08,3.81 v37.08,8.13 | v4.06,20.32 v4.06,16.51 4.06,13.72 v4.06,12.7 | v4.06,9.65 v4.06,5.08 | v26.16,8.89 26.16,9.91 31.75,9.91 v31.75,8.89 | v21.84,9.4 12.7,9.4 v12.7,6.6
VIN
  Top 0.61: Q1.2 11.43,18.54 11.18,18.29 11.18,17.78 11,17.6 Q1.6 9.91,17.58 9.91,15.75 9.83,15.67 U4.1
XIN
  Top 0.254: U2.7 23.91,8.92 23.62,8.64 22.86,8.64 22.17,7.94 22.17,7.11
XOUT
  Top 0.254: 24.57,7.11 24.57,8.03 U2.8

### Text on the board
tPlace: 5V | 3V
bPlace: A3 | A2 | A1 | A0 | D3 | D2 | D1 | D0 | A5 | A4 | 5V | GND | GND | GND | 5VDC_IN | PatternAgents | VCC | RS-485 | A | DO/RXD | TSOC_RS485_EM | D1/TXD | GND | !DTR | B | Rev 5.0 (AVR Version) | RS-485 | !RST | D10 | D13 | D12 | D11 | 3V3 | D4 | D5 | D6 | D7 | A7 | A6 | !DBG | GND